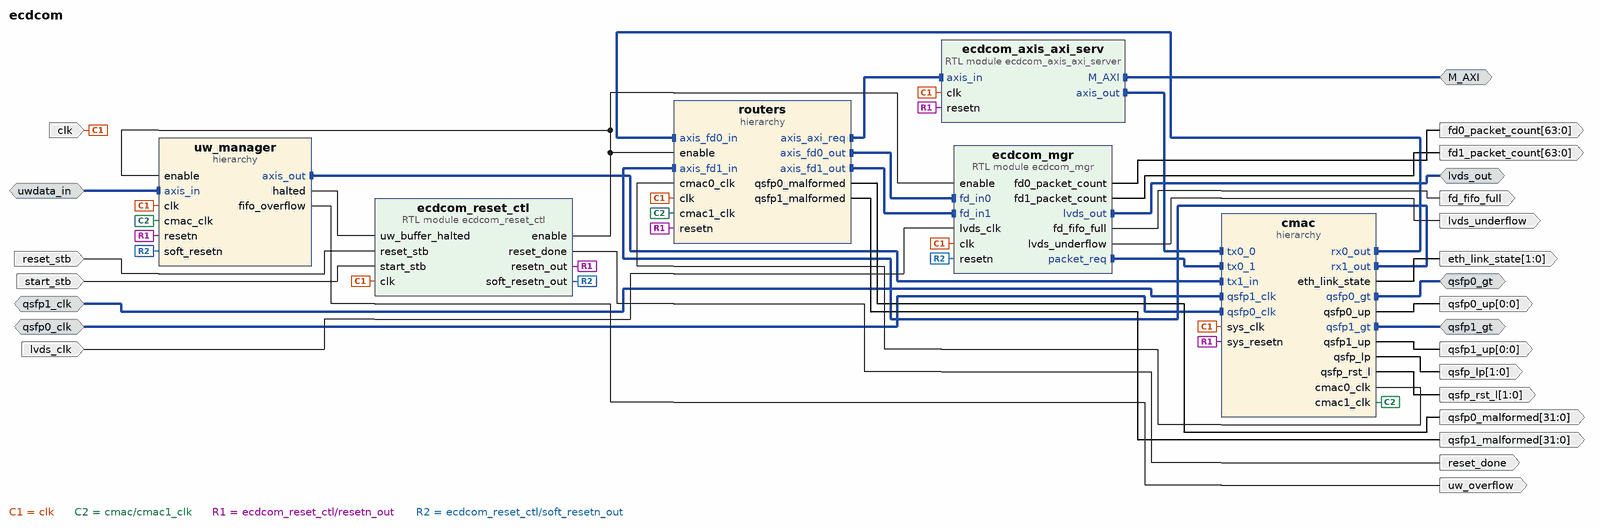
[diagram p0: block diagram of the top level]
# Vivado block design ecdcom, xcku15p-ffve1517-3-e, Vivado 2024.2
create_bd_design ecdcom

create_bd_intf_port -mode Master -vlnv xilinx.com:interface:axis_rtl:1.0 lvds_out
set_property -dict {CONFIG.FREQ_HZ 192000000} [get_bd_intf_ports lvds_out]
create_bd_intf_port -mode Slave -vlnv xilinx.com:interface:diff_clock_rtl:1.0 qsfp0_clk
set_property -dict {CONFIG.FREQ_HZ 322265625} [get_bd_intf_ports qsfp0_clk]
create_bd_intf_port -mode Master -vlnv xilinx.com:interface:gt_rtl:1.0 qsfp0_gt
create_bd_intf_port -mode Slave -vlnv xilinx.com:interface:diff_clock_rtl:1.0 qsfp1_clk
set_property -dict {CONFIG.FREQ_HZ 322265625} [get_bd_intf_ports qsfp1_clk]
create_bd_intf_port -mode Master -vlnv xilinx.com:interface:gt_rtl:1.0 qsfp1_gt
create_bd_intf_port -mode Slave -vlnv xilinx.com:interface:axis_rtl:1.0 uwdata_in
set_property -dict [list \
  CONFIG.FREQ_HZ 250000000 \
  CONFIG.HAS_TKEEP 0 \
  CONFIG.HAS_TLAST 1 \
  CONFIG.HAS_TREADY 0 \
  CONFIG.HAS_TSTRB 0 \
  CONFIG.LAYERED_METADATA undef \
  CONFIG.TDATA_NUM_BYTES 64 \
  CONFIG.TDEST_WIDTH 0 \
  CONFIG.TID_WIDTH 0 \
  CONFIG.TUSER_WIDTH 0 \
] [get_bd_intf_ports uwdata_in]
create_bd_intf_port -mode Master -vlnv xilinx.com:interface:aximm_rtl:1.0 M_AXI
set_property -dict [list \
  CONFIG.ADDR_WIDTH 32 \
  CONFIG.DATA_WIDTH 32 \
  CONFIG.FREQ_HZ 250000000 \
  CONFIG.HAS_BURST 0 \
  CONFIG.HAS_CACHE 0 \
  CONFIG.HAS_LOCK 0 \
  CONFIG.HAS_QOS 0 \
  CONFIG.HAS_REGION 0 \
  CONFIG.PROTOCOL AXI4LITE \
] [get_bd_intf_ports M_AXI]
create_bd_port -dir O -from 1 -to 0 eth_link_state
create_bd_port -dir O -from 63 -to 0 fd0_packet_count
create_bd_port -dir O -from 63 -to 0 fd1_packet_count
create_bd_port -dir O fd_fifo_full
create_bd_port -dir O lvds_underflow
create_bd_port -dir O -from 31 -to 0 qsfp0_malformed
create_bd_port -dir O -from 0 -to 0 qsfp0_up
create_bd_port -dir O -from 31 -to 0 qsfp1_malformed
create_bd_port -dir O -from 0 -to 0 qsfp1_up
create_bd_port -dir O -from 1 -to 0 qsfp_lp
create_bd_port -dir O -from 1 -to 0 qsfp_rst_l
create_bd_port -dir O reset_done
create_bd_port -dir I reset_stb
create_bd_port -dir O uw_overflow
create_bd_port -dir I -type clk lvds_clk
set_property -dict {CONFIG.FREQ_HZ 192000000} [get_bd_ports lvds_clk]
create_bd_port -dir I -type clk clk
set_property -dict {CONFIG.ASSOCIATED_BUSIF uwdata_in:M_AXI CONFIG.FREQ_HZ 250000000} [get_bd_ports clk]
create_bd_port -dir I start_stb

create_bd_cell -type hier cmac
create_bd_cell -type hier routers
create_bd_cell -type hier uw_manager
create_bd_cell -type module -reference ecdcom_reset_ctl ecdcom_reset_ctl
create_bd_cell -type module -reference ecdcom_axis_axi_server ecdcom_axis_axi_serv
create_bd_cell -type module -reference ecdcom_mgr ecdcom_mgr

# ---- hierarchy /cmac ----
current_bd_instance /cmac
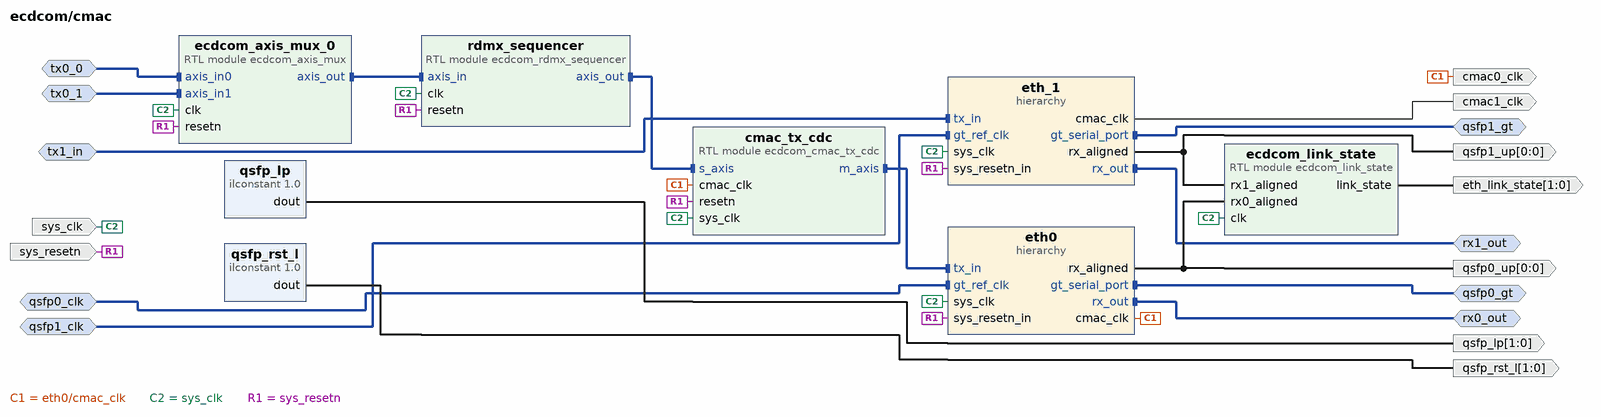
[diagram p1: block diagram inside /cmac]
create_bd_intf_pin -mode Master -vlnv xilinx.com:interface:gt_rtl:1.0 qsfp0_gt
create_bd_intf_pin -mode Slave -vlnv xilinx.com:interface:diff_clock_rtl:1.0 qsfp0_clk
create_bd_intf_pin -mode Master -vlnv xilinx.com:interface:gt_rtl:1.0 qsfp1_gt
create_bd_intf_pin -mode Slave -vlnv xilinx.com:interface:diff_clock_rtl:1.0 qsfp1_clk
create_bd_intf_pin -mode Slave -vlnv xilinx.com:interface:axis_rtl:1.0 tx1_in
create_bd_intf_pin -mode Master -vlnv xilinx.com:interface:axis_rtl:1.0 rx0_out
create_bd_intf_pin -mode Master -vlnv xilinx.com:interface:axis_rtl:1.0 rx1_out
create_bd_intf_pin -mode Slave -vlnv xilinx.com:interface:axis_rtl:1.0 tx0_0
create_bd_intf_pin -mode Slave -vlnv xilinx.com:interface:axis_rtl:1.0 tx0_1
create_bd_pin -dir I sys_clk
create_bd_pin -dir I sys_resetn
create_bd_pin -dir O -from 0 -to 0 qsfp0_up
create_bd_pin -dir O -from 0 -to 0 qsfp1_up
create_bd_pin -dir O -from 1 -to 0 qsfp_rst_l
create_bd_pin -dir O -from 1 -to 0 qsfp_lp
create_bd_pin -dir O -from 1 -to 0 eth_link_state
create_bd_pin -dir O cmac0_clk
create_bd_pin -dir O cmac1_clk

create_bd_cell -type hier eth0
create_bd_cell -type hier eth_1
create_bd_cell -type inline_hdl -vlnv xilinx.com:inline_hdl:ilconstant:1.0 qsfp_rst_l
set_property -dict {CONFIG.CONST_VAL 3 CONFIG.CONST_WIDTH 2} [get_bd_cells qsfp_rst_l]
create_bd_cell -type inline_hdl -vlnv xilinx.com:inline_hdl:ilconstant:1.0 qsfp_lp
set_property -dict {CONFIG.CONST_VAL 0 CONFIG.CONST_WIDTH 2} [get_bd_cells qsfp_lp]
create_bd_cell -type module -reference ecdcom_link_state ecdcom_link_state
create_bd_cell -type module -reference ecdcom_cmac_tx_cdc cmac_tx_cdc
create_bd_cell -type module -reference ecdcom_rdmx_sequencer rdmx_sequencer
create_bd_cell -type module -reference ecdcom_axis_mux ecdcom_axis_mux_0

# ---- hierarchy /cmac/eth0 ----
current_bd_instance /cmac/eth0
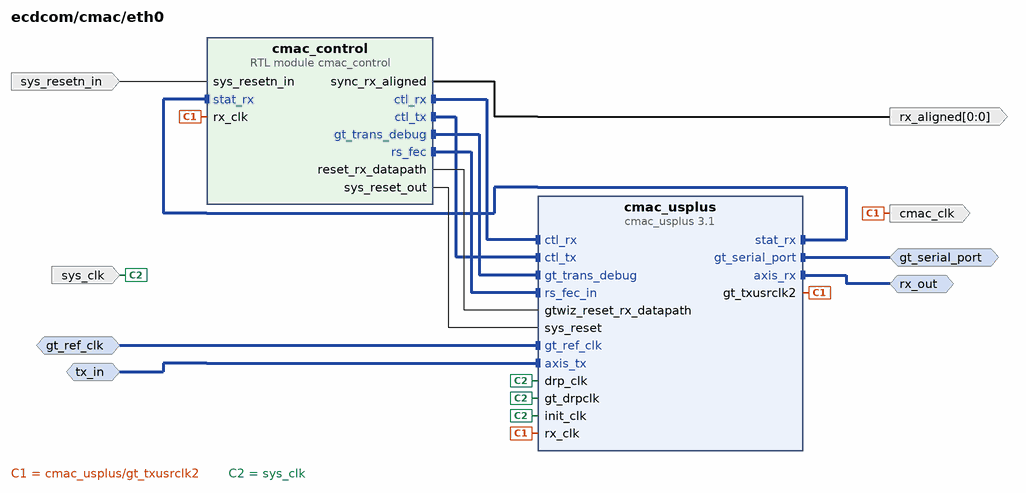
[diagram p2: block diagram inside /cmac/eth0]
create_bd_intf_pin -mode Master -vlnv xilinx.com:interface:gt_rtl:1.0 gt_serial_port
create_bd_intf_pin -mode Slave -vlnv xilinx.com:interface:diff_clock_rtl:1.0 gt_ref_clk
create_bd_intf_pin -mode Master -vlnv xilinx.com:interface:axis_rtl:1.0 rx_out
create_bd_intf_pin -mode Slave -vlnv xilinx.com:interface:axis_rtl:1.0 tx_in
create_bd_pin -dir I sys_resetn_in
create_bd_pin -dir I sys_clk
create_bd_pin -dir O -from 0 -to 0 rx_aligned
create_bd_pin -dir O cmac_clk

create_bd_cell -type ip -vlnv xilinx.com:ip:cmac_usplus:3.1 cmac_usplus
set_property -dict [list \
  CONFIG.ADD_GT_CNRL_STS_PORTS 1 \
  CONFIG.CMAC_CAUI4_MODE 1 \
  CONFIG.CMAC_CORE_SELECT CMACE4_X0Y0 \
  CONFIG.DIFFCLK_BOARD_INTERFACE Custom \
  CONFIG.ETHERNET_BOARD_INTERFACE Custom \
  CONFIG.GT_DRP_CLK 250 \
  CONFIG.GT_GROUP_SELECT {X0Y0~X0Y3} \
  CONFIG.GT_REF_CLK_FREQ 322.265625 \
  CONFIG.INCLUDE_RS_FEC 1 \
  CONFIG.NUM_LANES 4x25 \
  CONFIG.RX_FLOW_CONTROL 0 \
  CONFIG.RX_GT_BUFFER 1 \
  CONFIG.TX_FLOW_CONTROL 0 \
  CONFIG.USER_INTERFACE AXIS \
] [get_bd_cells cmac_usplus]
create_bd_cell -type module -reference cmac_control cmac_control
set_property -dict {CONFIG.TX_PRECURSOR {"10100"} CONFIG.USE_SYS_RESET_OUT 1} [get_bd_cells cmac_control]

# ---- hierarchy /cmac/eth_1 ----
current_bd_instance /cmac/eth_1
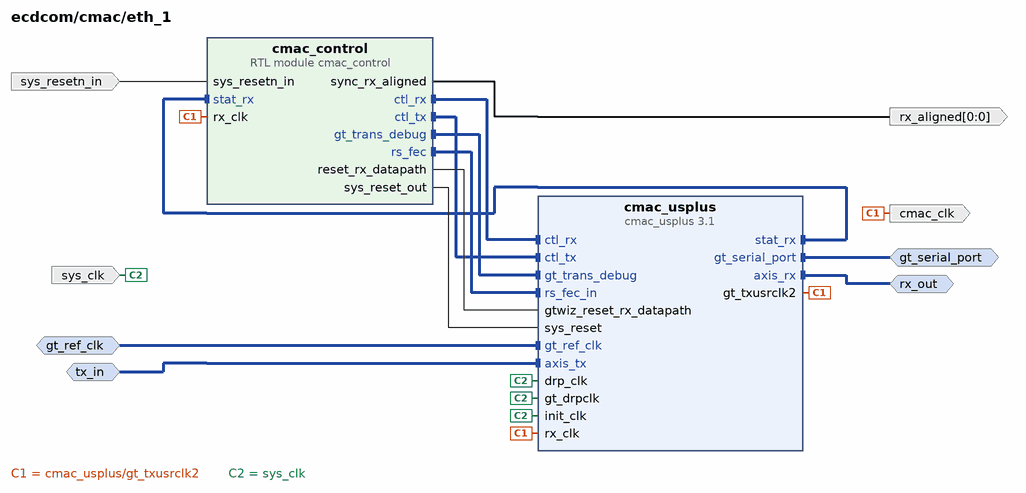
[diagram p3: block diagram inside /cmac/eth_1]
create_bd_intf_pin -mode Master -vlnv xilinx.com:interface:gt_rtl:1.0 gt_serial_port
create_bd_intf_pin -mode Slave -vlnv xilinx.com:interface:diff_clock_rtl:1.0 gt_ref_clk
create_bd_intf_pin -mode Master -vlnv xilinx.com:interface:axis_rtl:1.0 rx_out
create_bd_intf_pin -mode Slave -vlnv xilinx.com:interface:axis_rtl:1.0 tx_in
create_bd_pin -dir I sys_resetn_in
create_bd_pin -dir I sys_clk
create_bd_pin -dir O -from 0 -to 0 rx_aligned
create_bd_pin -dir O cmac_clk

create_bd_cell -type ip -vlnv xilinx.com:ip:cmac_usplus:3.1 cmac_usplus
set_property -dict [list \
  CONFIG.ADD_GT_CNRL_STS_PORTS 1 \
  CONFIG.CMAC_CAUI4_MODE 1 \
  CONFIG.CMAC_CORE_SELECT CMACE4_X0Y1 \
  CONFIG.DIFFCLK_BOARD_INTERFACE Custom \
  CONFIG.ETHERNET_BOARD_INTERFACE Custom \
  CONFIG.GT_DRP_CLK 250 \
  CONFIG.GT_GROUP_SELECT {X0Y4~X0Y7} \
  CONFIG.GT_REF_CLK_FREQ 322.265625 \
  CONFIG.INCLUDE_RS_FEC 1 \
  CONFIG.NUM_LANES 4x25 \
  CONFIG.RX_FLOW_CONTROL 0 \
  CONFIG.RX_GT_BUFFER 1 \
  CONFIG.TX_FLOW_CONTROL 0 \
  CONFIG.USER_INTERFACE AXIS \
] [get_bd_cells cmac_usplus]
create_bd_cell -type module -reference cmac_control cmac_control
set_property -dict {CONFIG.TX_PRECURSOR {"10100"} CONFIG.USE_SYS_RESET_OUT 1} [get_bd_cells cmac_control]

# ---- hierarchy /routers ----
current_bd_instance /routers
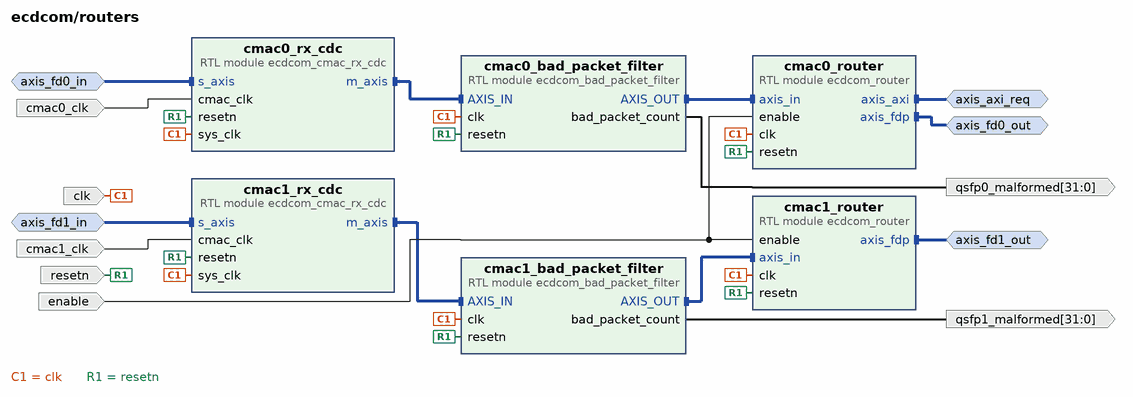
[diagram p4: block diagram inside /routers]
create_bd_intf_pin -mode Master -vlnv xilinx.com:interface:axis_rtl:1.0 axis_fd0_out
create_bd_intf_pin -mode Slave -vlnv xilinx.com:interface:axis_rtl:1.0 axis_fd0_in
create_bd_intf_pin -mode Master -vlnv xilinx.com:interface:axis_rtl:1.0 axis_fd1_out
create_bd_intf_pin -mode Slave -vlnv xilinx.com:interface:axis_rtl:1.0 axis_fd1_in
create_bd_intf_pin -mode Master -vlnv xilinx.com:interface:axis_rtl:1.0 axis_axi_req
create_bd_pin -dir I -type rst resetn
create_bd_pin -dir I enable
create_bd_pin -dir O -from 31 -to 0 qsfp0_malformed
create_bd_pin -dir O -from 31 -to 0 qsfp1_malformed
create_bd_pin -dir I -type clk clk
create_bd_pin -dir I cmac0_clk
create_bd_pin -dir I cmac1_clk

create_bd_cell -type module -reference ecdcom_router cmac0_router
create_bd_cell -type module -reference ecdcom_router cmac1_router
create_bd_cell -type module -reference ecdcom_bad_packet_filter cmac0_bad_packet_filter
create_bd_cell -type module -reference ecdcom_bad_packet_filter cmac1_bad_packet_filter
create_bd_cell -type module -reference ecdcom_cmac_rx_cdc cmac0_rx_cdc
create_bd_cell -type module -reference ecdcom_cmac_rx_cdc cmac1_rx_cdc

# ---- hierarchy /uw_manager ----
current_bd_instance /uw_manager
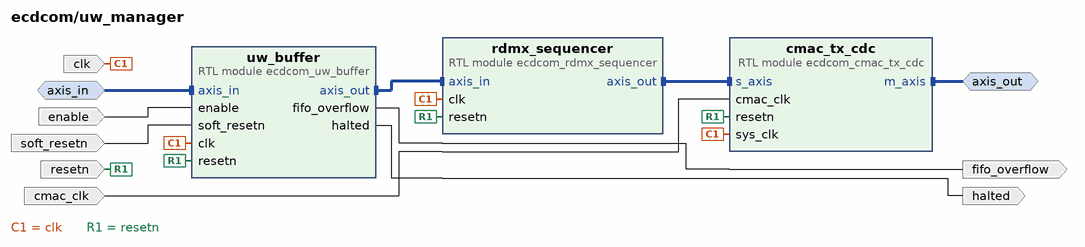
[diagram p5: block diagram inside /uw_manager]
create_bd_intf_pin -mode Slave -vlnv xilinx.com:interface:axis_rtl:1.0 axis_in
create_bd_intf_pin -mode Master -vlnv xilinx.com:interface:axis_rtl:1.0 axis_out
create_bd_pin -dir I clk
create_bd_pin -dir I -type rst resetn
create_bd_pin -dir O fifo_overflow
create_bd_pin -dir I cmac_clk
create_bd_pin -dir I soft_resetn
create_bd_pin -dir I enable
create_bd_pin -dir O halted

create_bd_cell -type module -reference ecdcom_uw_buffer uw_buffer
create_bd_cell -type module -reference ecdcom_rdmx_sequencer rdmx_sequencer
create_bd_cell -type module -reference ecdcom_cmac_tx_cdc cmac_tx_cdc

# ---- connections ----

current_bd_instance /cmac
connect_bd_intf_net -intf_net channel_1_qsfp_gt [get_bd_intf_pins qsfp1_gt] [get_bd_intf_pins eth_1/gt_serial_port]
connect_bd_intf_net [get_bd_intf_pins ecdcom_axis_mux_0/axis_out] [get_bd_intf_pins rdmx_sequencer/axis_in]
connect_bd_intf_net [get_bd_intf_pins qsfp0_gt] [get_bd_intf_pins eth0/gt_serial_port]
connect_bd_intf_net [get_bd_intf_pins rx0_out] [get_bd_intf_pins eth0/rx_out]
connect_bd_intf_net [get_bd_intf_pins rx1_out] [get_bd_intf_pins eth_1/rx_out]
connect_bd_intf_net -intf_net gt_ref_clk_0_1 [get_bd_intf_pins qsfp0_clk] [get_bd_intf_pins eth0/gt_ref_clk]
connect_bd_intf_net -intf_net mindy_core_AXIS_TX1 [get_bd_intf_pins tx1_in] [get_bd_intf_pins eth_1/tx_in]
connect_bd_intf_net -intf_net qsfp_clk_0_1 [get_bd_intf_pins qsfp1_clk] [get_bd_intf_pins eth_1/gt_ref_clk]
connect_bd_intf_net [get_bd_intf_pins cmac_tx_cdc/s_axis] [get_bd_intf_pins rdmx_sequencer/axis_out]
connect_bd_intf_net -intf_net tx0_0_1 [get_bd_intf_pins tx0_0] [get_bd_intf_pins ecdcom_axis_mux_0/axis_in0]
connect_bd_intf_net -intf_net tx0_1_1 [get_bd_intf_pins tx0_1] [get_bd_intf_pins ecdcom_axis_mux_0/axis_in1]
connect_bd_intf_net [get_bd_intf_pins eth0/tx_in] [get_bd_intf_pins cmac_tx_cdc/m_axis]
connect_bd_net -net channel_0_rx_aligned [get_bd_pins eth0/rx_aligned] [get_bd_pins qsfp0_up] [get_bd_pins ecdcom_link_state/rx0_aligned]
connect_bd_net -net channel_1_rx_aligned [get_bd_pins eth_1/rx_aligned] [get_bd_pins qsfp1_up] [get_bd_pins ecdcom_link_state/rx1_aligned]
connect_bd_net [get_bd_pins ecdcom_link_state/link_state] [get_bd_pins eth_link_state]
connect_bd_net [get_bd_pins eth0/cmac_clk] [get_bd_pins cmac0_clk] [get_bd_pins cmac_tx_cdc/cmac_clk]
connect_bd_net [get_bd_pins eth_1/cmac_clk] [get_bd_pins cmac1_clk]
connect_bd_net -net pcie_bridge_0_axi_aclk [get_bd_pins sys_clk] \
  [get_bd_pins eth0/sys_clk] [get_bd_pins eth_1/sys_clk] [get_bd_pins ecdcom_link_state/clk] \
  [get_bd_pins cmac_tx_cdc/sys_clk] [get_bd_pins rdmx_sequencer/clk] [get_bd_pins ecdcom_axis_mux_0/clk]
connect_bd_net -net pcie_bridge_0_axi_aresetn [get_bd_pins sys_resetn] \
  [get_bd_pins eth0/sys_resetn_in] [get_bd_pins eth_1/sys_resetn_in] [get_bd_pins cmac_tx_cdc/resetn] \
  [get_bd_pins rdmx_sequencer/resetn] [get_bd_pins ecdcom_axis_mux_0/resetn]
connect_bd_net [get_bd_pins qsfp_lp/dout] [get_bd_pins qsfp_lp]
connect_bd_net [get_bd_pins qsfp_rst_l/dout] [get_bd_pins qsfp_rst_l]

current_bd_instance /cmac/eth0
connect_bd_intf_net [get_bd_intf_pins cmac_control/ctl_rx] [get_bd_intf_pins cmac_usplus/ctl_rx]
connect_bd_intf_net [get_bd_intf_pins cmac_control/ctl_tx] [get_bd_intf_pins cmac_usplus/ctl_tx]
connect_bd_intf_net [get_bd_intf_pins cmac_control/gt_trans_debug] [get_bd_intf_pins cmac_usplus/gt_trans_debug]
connect_bd_intf_net [get_bd_intf_pins cmac_control/rs_fec] [get_bd_intf_pins cmac_usplus/rs_fec_in]
connect_bd_intf_net [get_bd_intf_pins rx_out] [get_bd_intf_pins cmac_usplus/axis_rx]
connect_bd_intf_net [get_bd_intf_pins gt_serial_port] [get_bd_intf_pins cmac_usplus/gt_serial_port]
connect_bd_intf_net [get_bd_intf_pins cmac_control/stat_rx] [get_bd_intf_pins cmac_usplus/stat_rx]
connect_bd_intf_net [get_bd_intf_pins gt_ref_clk] [get_bd_intf_pins cmac_usplus/gt_ref_clk]
connect_bd_intf_net [get_bd_intf_pins tx_in] [get_bd_intf_pins cmac_usplus/axis_tx]
connect_bd_net [get_bd_pins cmac_control/reset_rx_datapath] [get_bd_pins cmac_usplus/gtwiz_reset_rx_datapath]
connect_bd_net [get_bd_pins cmac_control/sync_rx_aligned] [get_bd_pins rx_aligned]
connect_bd_net [get_bd_pins cmac_control/sys_reset_out] [get_bd_pins cmac_usplus/sys_reset]
connect_bd_net [get_bd_pins cmac_usplus/gt_txusrclk2] [get_bd_pins cmac_usplus/rx_clk] [get_bd_pins cmac_clk] [get_bd_pins cmac_control/rx_clk]
connect_bd_net [get_bd_pins sys_clk] [get_bd_pins cmac_usplus/gt_drpclk] [get_bd_pins cmac_usplus/init_clk] [get_bd_pins cmac_usplus/drp_clk]
connect_bd_net [get_bd_pins sys_resetn_in] [get_bd_pins cmac_control/sys_resetn_in]

current_bd_instance /cmac/eth_1
connect_bd_intf_net [get_bd_intf_pins cmac_control/ctl_rx] [get_bd_intf_pins cmac_usplus/ctl_rx]
connect_bd_intf_net [get_bd_intf_pins cmac_control/ctl_tx] [get_bd_intf_pins cmac_usplus/ctl_tx]
connect_bd_intf_net [get_bd_intf_pins cmac_control/gt_trans_debug] [get_bd_intf_pins cmac_usplus/gt_trans_debug]
connect_bd_intf_net [get_bd_intf_pins cmac_control/rs_fec] [get_bd_intf_pins cmac_usplus/rs_fec_in]
connect_bd_intf_net [get_bd_intf_pins rx_out] [get_bd_intf_pins cmac_usplus/axis_rx]
connect_bd_intf_net [get_bd_intf_pins gt_serial_port] [get_bd_intf_pins cmac_usplus/gt_serial_port]
connect_bd_intf_net [get_bd_intf_pins cmac_control/stat_rx] [get_bd_intf_pins cmac_usplus/stat_rx]
connect_bd_intf_net [get_bd_intf_pins gt_ref_clk] [get_bd_intf_pins cmac_usplus/gt_ref_clk]
connect_bd_intf_net [get_bd_intf_pins tx_in] [get_bd_intf_pins cmac_usplus/axis_tx]
connect_bd_net [get_bd_pins cmac_control/reset_rx_datapath] [get_bd_pins cmac_usplus/gtwiz_reset_rx_datapath]
connect_bd_net [get_bd_pins cmac_control/sync_rx_aligned] [get_bd_pins rx_aligned]
connect_bd_net [get_bd_pins cmac_control/sys_reset_out] [get_bd_pins cmac_usplus/sys_reset]
connect_bd_net [get_bd_pins cmac_usplus/gt_txusrclk2] [get_bd_pins cmac_usplus/rx_clk] [get_bd_pins cmac_clk] [get_bd_pins cmac_control/rx_clk]
connect_bd_net [get_bd_pins sys_clk] [get_bd_pins cmac_usplus/gt_drpclk] [get_bd_pins cmac_usplus/init_clk] [get_bd_pins cmac_usplus/drp_clk]
connect_bd_net [get_bd_pins sys_resetn_in] [get_bd_pins cmac_control/sys_resetn_in]

current_bd_instance /routers
connect_bd_intf_net [get_bd_intf_pins axis_fd0_in] [get_bd_intf_pins cmac0_rx_cdc/s_axis]
connect_bd_intf_net [get_bd_intf_pins axis_fd1_in] [get_bd_intf_pins cmac1_rx_cdc/s_axis]
connect_bd_intf_net [get_bd_intf_pins axis_axi_req] [get_bd_intf_pins cmac0_router/axis_axi]
connect_bd_intf_net -intf_net cmac0_rx_cdc1_m_axis [get_bd_intf_pins cmac1_rx_cdc/m_axis] [get_bd_intf_pins cmac1_bad_packet_filter/AXIS_IN]
connect_bd_intf_net -intf_net ecdcom_cmac_rx_cdc_0_m_axis [get_bd_intf_pins cmac0_rx_cdc/m_axis] [get_bd_intf_pins cmac0_bad_packet_filter/AXIS_IN]
connect_bd_intf_net -intf_net ecdcom_router_0_axis_fdp [get_bd_intf_pins axis_fd0_out] [get_bd_intf_pins cmac0_router/axis_fdp]
connect_bd_intf_net -intf_net ecdcom_router_1_axis_fdp [get_bd_intf_pins axis_fd1_out] [get_bd_intf_pins cmac1_router/axis_fdp]
connect_bd_intf_net -intf_net qsfp0_bad_packet_filter_AXIS_OUT [get_bd_intf_pins cmac0_bad_packet_filter/AXIS_OUT] [get_bd_intf_pins cmac0_router/axis_in]
connect_bd_intf_net -intf_net qsfp1_bad_packet_filter_AXIS_OUT [get_bd_intf_pins cmac1_bad_packet_filter/AXIS_OUT] [get_bd_intf_pins cmac1_router/axis_in]
connect_bd_net -net clk_0_1 [get_bd_pins clk] \
  [get_bd_pins cmac1_bad_packet_filter/clk] [get_bd_pins cmac0_bad_packet_filter/clk] [get_bd_pins cmac1_rx_cdc/sys_clk] \
  [get_bd_pins cmac0_rx_cdc/sys_clk] [get_bd_pins cmac0_router/clk] [get_bd_pins cmac1_router/clk]
connect_bd_net [get_bd_pins cmac0_clk] [get_bd_pins cmac0_rx_cdc/cmac_clk]
connect_bd_net [get_bd_pins cmac1_clk] [get_bd_pins cmac1_rx_cdc/cmac_clk]
connect_bd_net -net ecdcom_mgr_enable [get_bd_pins enable] [get_bd_pins cmac0_router/enable] [get_bd_pins cmac1_router/enable]
connect_bd_net -net qsfp0_bad_packet_filter_bad_packet_count [get_bd_pins cmac0_bad_packet_filter/bad_packet_count] [get_bd_pins qsfp0_malformed]
connect_bd_net -net qsfp1_bad_packet_filter_bad_packet_count [get_bd_pins cmac1_bad_packet_filter/bad_packet_count] [get_bd_pins qsfp1_malformed]
connect_bd_net -net reset_mgr_resetn_out [get_bd_pins resetn] \
  [get_bd_pins cmac0_bad_packet_filter/resetn] [get_bd_pins cmac1_bad_packet_filter/resetn] [get_bd_pins cmac1_rx_cdc/resetn] \
  [get_bd_pins cmac0_rx_cdc/resetn] [get_bd_pins cmac0_router/resetn] [get_bd_pins cmac1_router/resetn]

current_bd_instance /uw_manager
connect_bd_intf_net [get_bd_intf_pins axis_out] [get_bd_intf_pins cmac_tx_cdc/m_axis]
connect_bd_intf_net -intf_net ecdcom_uw_buffer_axis_out [get_bd_intf_pins uw_buffer/axis_out] [get_bd_intf_pins rdmx_sequencer/axis_in]
connect_bd_intf_net [get_bd_intf_pins cmac_tx_cdc/s_axis] [get_bd_intf_pins rdmx_sequencer/axis_out]
connect_bd_intf_net -intf_net uwdata_in_1 [get_bd_intf_pins axis_in] [get_bd_intf_pins uw_buffer/axis_in]
connect_bd_net [get_bd_pins clk] [get_bd_pins rdmx_sequencer/clk] [get_bd_pins cmac_tx_cdc/sys_clk] [get_bd_pins uw_buffer/clk]
connect_bd_net [get_bd_pins cmac_clk] [get_bd_pins cmac_tx_cdc/cmac_clk]
connect_bd_net [get_bd_pins enable] [get_bd_pins uw_buffer/enable]
connect_bd_net -net reset_mgr_resetn_out [get_bd_pins resetn] \
  [get_bd_pins rdmx_sequencer/resetn] [get_bd_pins cmac_tx_cdc/resetn] [get_bd_pins uw_buffer/resetn]
connect_bd_net [get_bd_pins soft_resetn] [get_bd_pins uw_buffer/soft_resetn]
connect_bd_net [get_bd_pins uw_buffer/fifo_overflow] [get_bd_pins fifo_overflow]
connect_bd_net [get_bd_pins uw_buffer/halted] [get_bd_pins halted]

current_bd_instance /
connect_bd_intf_net [get_bd_intf_pins cmac/qsfp1_clk] [get_bd_intf_ports qsfp1_clk]
connect_bd_intf_net [get_bd_intf_pins cmac/qsfp0_clk] [get_bd_intf_ports qsfp0_clk]
connect_bd_intf_net [get_bd_intf_pins cmac/qsfp0_gt] [get_bd_intf_ports qsfp0_gt]
connect_bd_intf_net [get_bd_intf_pins cmac/qsfp1_gt] [get_bd_intf_ports qsfp1_gt]
connect_bd_intf_net [get_bd_intf_pins routers/axis_fd0_in] [get_bd_intf_pins cmac/rx0_out]
connect_bd_intf_net [get_bd_intf_pins routers/axis_fd1_in] [get_bd_intf_pins cmac/rx1_out]
connect_bd_intf_net -intf_net ecdcom_axis_axi_serv_0_M_AXI [get_bd_intf_pins ecdcom_axis_axi_serv/M_AXI] [get_bd_intf_ports M_AXI]
connect_bd_intf_net -intf_net ecdcom_axis_axi_serv_0_axis_out [get_bd_intf_pins ecdcom_axis_axi_serv/axis_out] [get_bd_intf_pins cmac/tx0_0]
connect_bd_intf_net [get_bd_intf_ports lvds_out] [get_bd_intf_pins ecdcom_mgr/lvds_out]
connect_bd_intf_net -intf_net ecdcom_router_0_axis_fdp [get_bd_intf_pins routers/axis_fd0_out] [get_bd_intf_pins ecdcom_mgr/fd_in0]
connect_bd_intf_net -intf_net ecdcom_router_1_axis_fdp [get_bd_intf_pins routers/axis_fd1_out] [get_bd_intf_pins ecdcom_mgr/fd_in1]
connect_bd_intf_net -intf_net fd_manager_packet_req [get_bd_intf_pins ecdcom_mgr/packet_req] [get_bd_intf_pins cmac/tx0_1]
connect_bd_intf_net -intf_net rdmx_sequencer_1_axis_out [get_bd_intf_pins uw_manager/axis_out] [get_bd_intf_pins cmac/tx1_in]
connect_bd_intf_net [get_bd_intf_pins routers/axis_axi_req] [get_bd_intf_pins ecdcom_axis_axi_serv/axis_in]
connect_bd_intf_net [get_bd_intf_ports uwdata_in] [get_bd_intf_pins uw_manager/axis_in]
connect_bd_net -net clk_0_2 [get_bd_ports clk] \
  [get_bd_pins routers/clk] [get_bd_pins cmac/sys_clk] [get_bd_pins uw_manager/clk] [get_bd_pins ecdcom_axis_axi_serv/clk] \
  [get_bd_pins ecdcom_mgr/clk] [get_bd_pins ecdcom_reset_ctl/clk]
connect_bd_net [get_bd_pins cmac/cmac0_clk] [get_bd_pins routers/cmac0_clk]
connect_bd_net [get_bd_pins cmac/cmac1_clk] [get_bd_pins routers/cmac1_clk] [get_bd_pins uw_manager/cmac_clk]
connect_bd_net [get_bd_pins cmac/eth_link_state] [get_bd_ports eth_link_state]
connect_bd_net [get_bd_pins cmac/qsfp0_up] [get_bd_ports qsfp0_up]
connect_bd_net [get_bd_pins cmac/qsfp1_up] [get_bd_ports qsfp1_up]
connect_bd_net [get_bd_pins cmac/qsfp_lp] [get_bd_ports qsfp_lp]
connect_bd_net [get_bd_pins cmac/qsfp_rst_l] [get_bd_ports qsfp_rst_l]
connect_bd_net [get_bd_pins ecdcom_mgr/fd0_packet_count] [get_bd_ports fd0_packet_count]
connect_bd_net [get_bd_pins ecdcom_mgr/fd1_packet_count] [get_bd_ports fd1_packet_count]
connect_bd_net [get_bd_pins ecdcom_mgr/fd_fifo_full] [get_bd_ports fd_fifo_full]
connect_bd_net [get_bd_pins ecdcom_mgr/lvds_underflow] [get_bd_ports lvds_underflow]
connect_bd_net [get_bd_pins ecdcom_reset_ctl/reset_done] [get_bd_ports reset_done]
connect_bd_net -net enable_1 [get_bd_pins ecdcom_reset_ctl/enable] \
  [get_bd_pins uw_manager/enable] [get_bd_pins routers/enable] [get_bd_pins ecdcom_mgr/enable]
connect_bd_net -net lvds_clk_0_1 [get_bd_ports lvds_clk] [get_bd_pins ecdcom_mgr/lvds_clk]
connect_bd_net -net reset_mgr_resetn_out [get_bd_pins ecdcom_reset_ctl/resetn_out] \
  [get_bd_pins routers/resetn] [get_bd_pins uw_manager/resetn] [get_bd_pins ecdcom_axis_axi_serv/resetn] \
  [get_bd_pins cmac/sys_resetn]
connect_bd_net [get_bd_ports reset_stb] [get_bd_pins ecdcom_reset_ctl/reset_stb]
connect_bd_net [get_bd_pins routers/qsfp0_malformed] [get_bd_ports qsfp0_malformed]
connect_bd_net [get_bd_pins routers/qsfp1_malformed] [get_bd_ports qsfp1_malformed]
connect_bd_net -net soft_resetn_1 [get_bd_pins ecdcom_reset_ctl/soft_resetn_out] [get_bd_pins uw_manager/soft_resetn] [get_bd_pins ecdcom_mgr/resetn]
connect_bd_net [get_bd_ports start_stb] [get_bd_pins ecdcom_reset_ctl/start_stb]
connect_bd_net [get_bd_pins uw_manager/fifo_overflow] [get_bd_ports uw_overflow]
connect_bd_net [get_bd_pins uw_manager/halted] [get_bd_pins ecdcom_reset_ctl/uw_buffer_halted]

# ---- address map ----
assign_bd_address -offset 0x00000000 -range 4G -target_address_space [get_bd_addr_spaces ecdcom_axis_axi_serv/M_AXI] [get_bd_addr_segs M_AXI/Reg]

validate_bd_design
save_bd_design
